# EAGLE design DCDCDC-R2 (EAGLE 9.5.1)
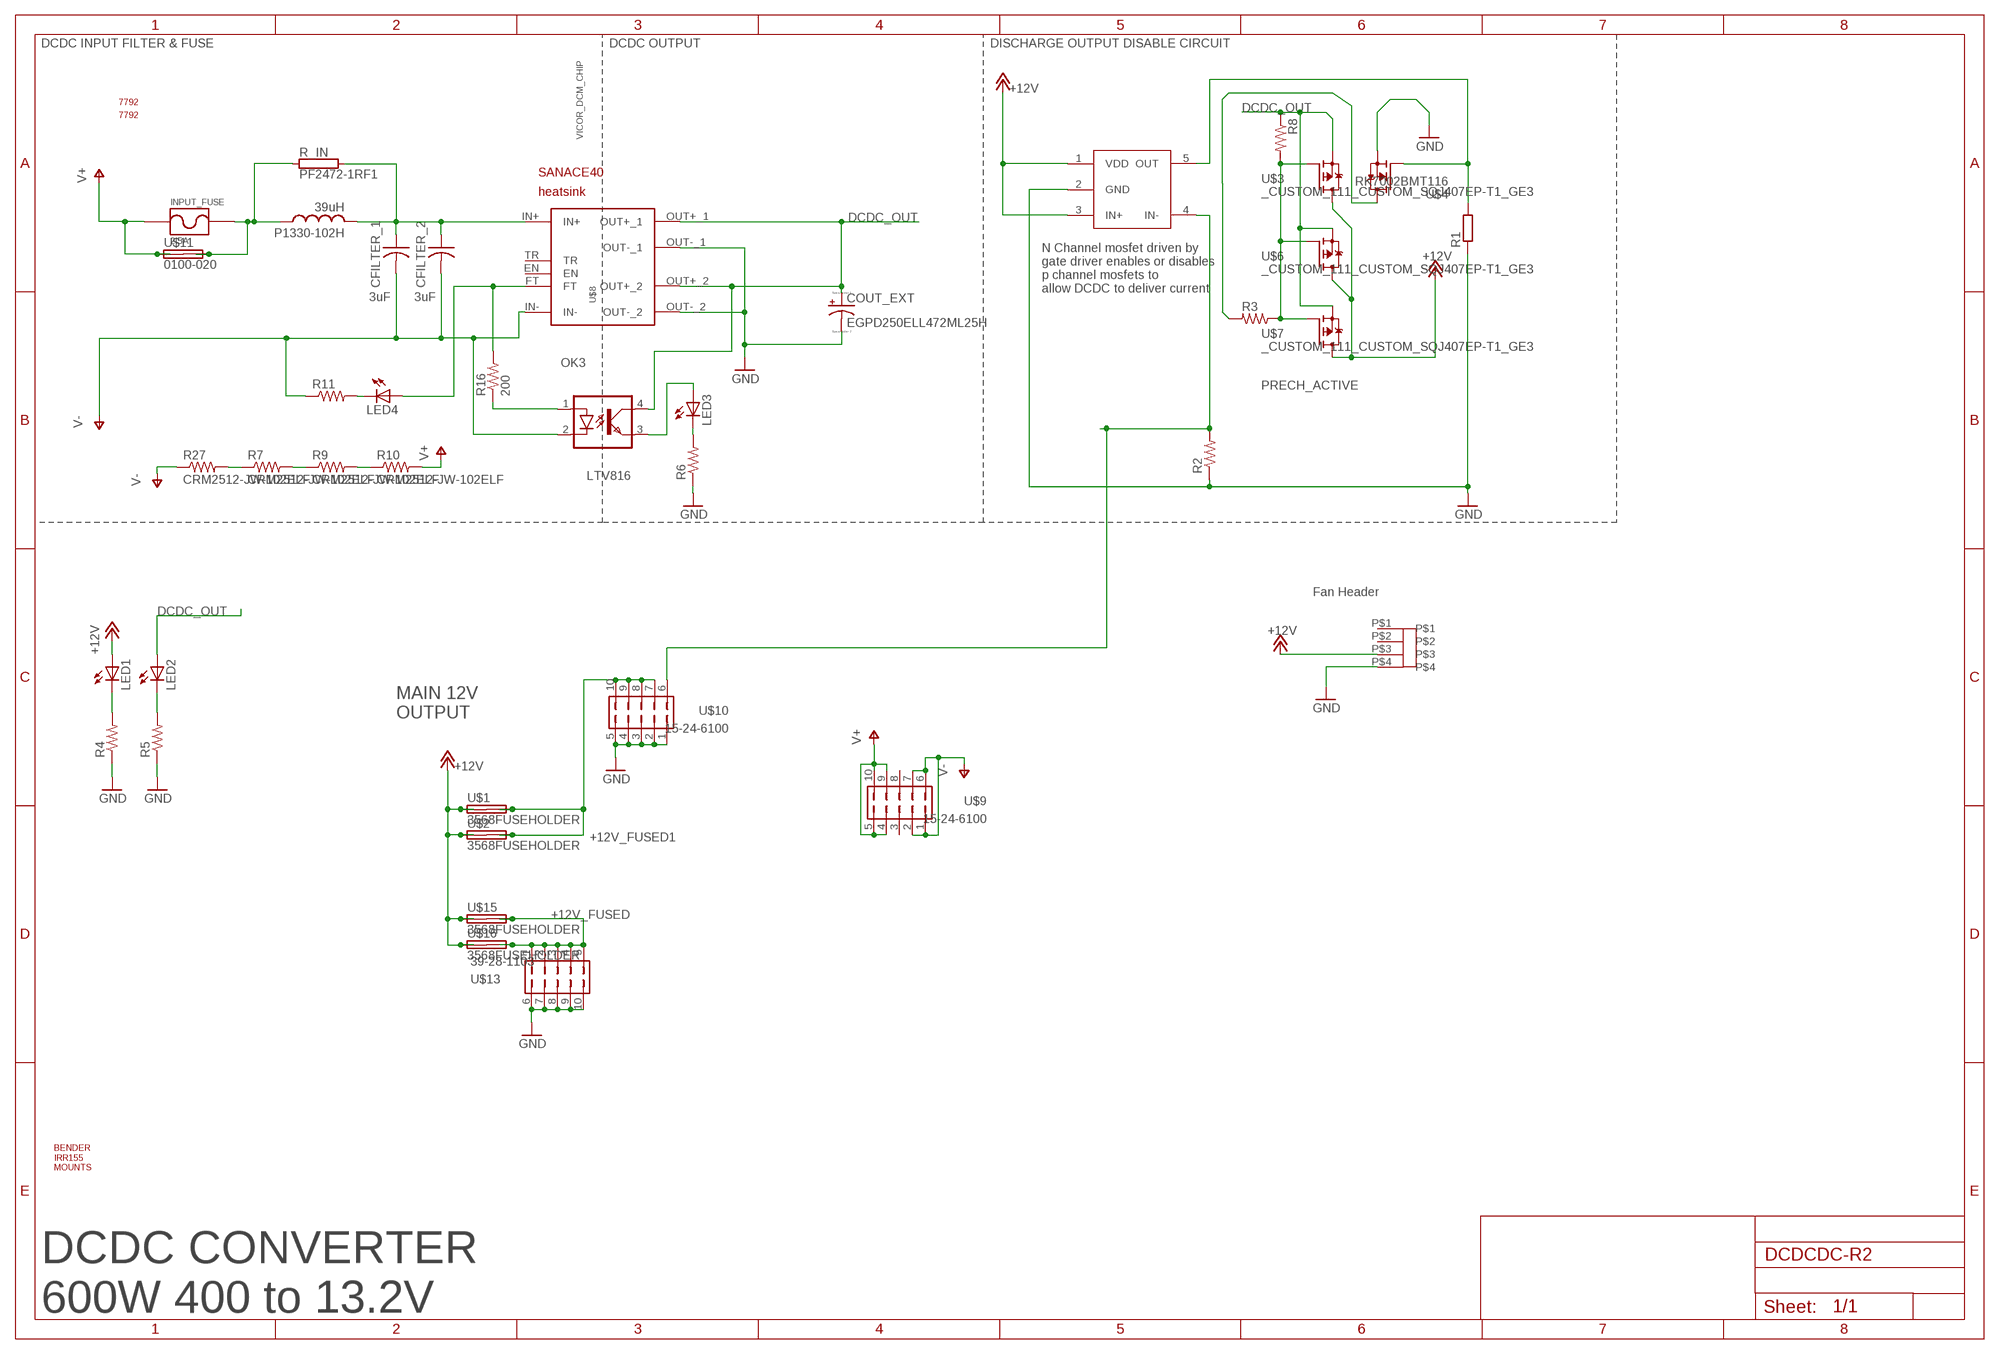
[diagram p0: schematic, sheet 1]

## Parts
CFILTER_1  3uF  B58035U5305M062  [CERALINK_FA3]
CFILTER_2  3uF  B58035U5305M062  [CERALINK_FA3]
COUT_EXT  EGPD250ELL472ML25H  CPOL-USE7.5-16  [E7,5-16]
INPUT_FUSE  2.5A  _CUSTOM_PARTS_LF_885  [_CUSTOM_PARTS_LF_885]
LED1  LEDCHIPLED_0805  [CHIPLED_0805]
LED2  LEDCHIPLED_0805  [CHIPLED_0805]
LED3  LEDCHIPLED_0805  [CHIPLED_0805]
LED4  LEDCHIPLED_0805  [CHIPLED_0805]
OK3  LTV816  [DIL04]
P1330-102H  39uH  SRP1770TA-390M  [L_1510_NONSTANDARD]
R1  R-EU_R0805  [R0805]
R2  R-US_R0805  [R0805]
R3  R-US_R0805  [R0805]
R4  R-US_R0805  [R0805]
R5  R-US_R0805  [R0805]
R6  R-US_R0805  [R0805]
R7  CRM2512-JW-102ELF  R-US_R2512  [R2512]
R8  R-US_R0805  [R0805]
R9  CRM2512-JW-102ELF  R-US_R2512  [R2512]
R10  CRM2512-JW-102ELF  R-US_R2512  [R2512]
R11  R-US_R0805  [R0805]
R16  200  R-US_R2010  [R2010]
R27  CRM2512-JW-102ELF  R-US_R2512  [R2512]
R_IN  PF2472-1RF1  RMG100-V  [TO-247-2V]
U$1  3568FUSEHOLDER  [3568]
U$2  3568FUSEHOLDER  [3568]
U$3  _CUSTOM_111_CUSTOM_SQJ407EP-T1_GE3  [_CUSTOM_111_CUSTOM_TRANS_SIRA90DP-T1-GE3]
U$4  RK7002BMT116  [SOT23]
U$5  UCC27511AQDBVRQ1  [SOT23-5L]
U$6  _CUSTOM_111_CUSTOM_SQJ407EP-T1_GE3  [_CUSTOM_111_CUSTOM_TRANS_SIRA90DP-T1-GE3]
U$7  _CUSTOM_111_CUSTOM_SQJ407EP-T1_GE3  [_CUSTOM_111_CUSTOM_TRANS_SIRA90DP-T1-GE3]
U$8  VICOR_DCM_CHIP  [VICOR_CHIP_HEATSINK]
U$9  15-24-6100  [15-24-6100]
U$10  15-24-6100  [15-24-6100]
U$11  0100-020  [0100-020]
U$12  VICOR_HEATSINK_DOUBLE  [VICOR_HEATSINK_DOUBLE]
U$13  39-28-1103  [39-28-1103]
U$14  7792  [7792]
U$15  3568FUSEHOLDER  [3568]
U$16  3568FUSEHOLDER  [3568]
U$17  7792  [7792]
U$18  9GAX0412P3S0031  SANACE40  [SANACE40]
U$19  470531000  [470531000]
U$20  BENDER_IRR155  [BENDER_IRR155]

## Nets
+12V: LED1.A U$1.L1(1A) U$1.L2(1B) U$2.L1(1A) U$2.L2(1B) U$3.5(D) U$5.1(VDD) U$5.3(IN+) U$6.5(D) U$7.5(D) U$15.L1(1A) U$15.L2(1B) U$16.L1(1A) U$16.L2(1B) U$19.P$3
+12V_FUSED: U$13.1 U$13.2 U$13.3 U$13.4 U$13.5 U$15.R1(2A) U$15.R2(2B) U$16.R1(2A) U$16.R2(2B)
+12V_FUSED1: U$1.R1(2A) U$1.R2(2B) U$2.R1(2A) U$2.R2(2B) U$10.7 U$10.8 U$10.9 U$10.10
DCDC_OUT: COUT_EXT.+ LED2.A OK3.4(COL) R8.1 U$3.1(S) U$3.2(S) U$3.3(S) U$6.1(S) U$6.2(S) U$6.3(S) U$7.1(S) U$7.2(S) U$7.3(S) U$8.OUT+_1 U$8.OUT+_2
GND: COUT_EXT.- R1.1 R2.1 R4.1 R5.1 R6.1 U$4.2(S) U$5.2(GND) U$8.OUT-_1 U$8.OUT-_2 U$10.1 U$10.2 U$10.3 U$10.4 U$10.5 U$13.6 U$13.7 U$13.8 U$13.9 U$13.10 U$19.P$4
N$1: R3.1 R8.2 U$3.4(G) U$6.4(G) U$7.4(G)
N$2: R1.2 U$4.1(G) U$5.5(OUT)
N$3 [HV]: CFILTER_1.P$1 CFILTER_2.P$1 P1330-102H.P$2 R_IN.2 U$8.IN+
N$4: R3.2 U$4.3(D)
N$5: LED1.C R4.2
N$6: LED2.C R5.2
N$7: LED4.A R16.2 U$8.FT
N$8: OK3.1(A) R16.1
N$9: LED3.C R6.2
N$10: LED3.A OK3.3(EMIT)
N$11: LED4.C R11.2
N$12: R7.1 R27.2
N$13: R7.2 R9.1
N$14: R9.2 R10.1
PRECH_ACTIVE: R2.2 U$5.4(IN-) U$10.6
V+ [HV]: INPUT_FUSE.P$1 R10.2 U$9.4 U$9.5 U$9.9 U$9.10 U$11.P$1(1A) U$11.P$3(1B)
V+_FUSED [HV]: INPUT_FUSE.P$2 P1330-102H.P$1 R_IN.1 U$11.P$2(2A) U$11.P$4(2B)
V- [HV]: CFILTER_1.P$2 CFILTER_2.P$2 OK3.2(C) R11.1 R27.1 U$8.IN- U$9.1 U$9.2 U$9.6 U$9.7
Unconnected: U$8.EN U$8.TR U$9.3 U$9.8 U$19.P$1 U$19.P$2

## Notes on the sheet
- DCDC INPUT FILTER & FUSE | DCDC OUTPUT | DISCHARGE OUTPUT DISABLE CIRCUIT
- N Channel mosfet driven by 
  gate driver enables or disables 
  p channel mosfets to 
  allow DCDC to deliver current
- Fan Header
- MAIN 12V
  OUTPUT
- DCDC CONVERTER 
  600W 400 to 13.2V

## Library data of the parts
CFILTER_1 CFILTER_2 = ACC-MB-R0:B58035U5305M062
COUT_EXT = ACC-MB-R0:CPOL-US: POLARIZED CAPACITOR, American symbol
INPUT_FUSE = ACC-MB-R0:_CUSTOM_PARTS_LF_885
LED1-LED4 = ACC-MB-R0:LED: LED OSRAM: - CHIPLED LG R971, LG N971, LY N971, LG Q971, LY Q971, LO R971, LY R971 LH N974, LH R974 LS Q976, LO Q976, LY Q976 LO Q996 - Hyper CHIPLED LW Q18S LB Q993, LB Q99A, LB R99A - SideLED LS A670, LO A670, LY A670, LG A670, LP A670 LB A673, LV A673, LT A673, LW A673 LH A674 LY A675 LS A676, LA A676, LO A676, LY A676, LW A676 LS A679, LY A679, LG A679 - Hyper Micro SIDELED® LS Y876, LA Y876, LO Y876, LY Y876 LT Y87S - SmartLED LW L88C, LW L88S LB L89C, LB L89S, LG L890 LS L89K, LO L89K, LY L89K LS L896, LA L896, LO L896, LY L896 - TOPLED LS T670, LO T670, LY T670, LG T670, LP T670 LSG T670, LSP T670, LSY T670, LOP T670, LYG T670 LG T671, LOG T671, LSG T671 LB T673, LV T673, LT T673, LW T673 LH T674 LS T676, LA T676, LO T676, LY T676, LB T676, LH T676, LSB T676, LW T676 LB T67C, LV T67C, LT T67C, LS T67K, LO T67K, LY T67K, LW E67C LS E67B, LA E67B, LO E67B, LY E67B, LB E67C, LV E67C, LT E67C LW T67C LS T679, LY T679, LG T679 LS T770, LO T770, LY T770, LG T770, LP T770 LB T773, LV T773, LT T773, LW T773 LH T774 LS E675, LA E675, LY E675, LS T675 LS T776, LA T776, LO T776, LY T776, LB T776 LHGB T686 LT T68C, LB T68C - Hyper Mini TOPLED® LB M676 - Mini TOPLED Santana® LG M470 LS M47K, LO M47K, LY M47K Source: http://www.osram.convergy.de LUXEON: - LUMILED® LXK2-PW12-R00, LXK2-PW12-S00, LXK2-PW14-U00, LXK2-PW14-V00 LXK2-PM12-R00, LXK2-PM12-S00, LXK2-PM14-U00 LXK2-PE12-Q00, LXK2-PE12-R00, LXK2-PE12-S00, LXK2-PE14-T00, LXK2-PE14-U00 LXK2-PB12-K00, LXK2-PB12-L00, LXK2-PB12-M00, LXK2-PB14-N00, LXK2-PB14-P00, LXK2-PB14-Q00 LXK2-PR12-L00, LXK2-PR12-M00, LXK2-PR14-Q00, LXK2-PR14-R00 LXK2-PD12-Q00, LXK2-PD12-R00, LXK2-PD12-S00 LXK2-PH12-R00, LXK2-PH12-S00 LXK2-PL12-P00, LXK2-PL12-Q00, LXK2-PL12-R00 Source: www.luxeon.com KINGBRIGHT: KA-3528ASYC Source: www.kingbright.com
OK3 = optocoupler:LTV816: OPTO COUPLER Source: LITEON, LTV816.pdf; OC_FARNELL: unknown; OC_NEWARK: unknown
P1330-102H = ACC-MB-R0:SRP1770TA-390M
R1 = ACC-MB-R0:R-EU_: RESISTOR, European symbol; SPICEPREFIX: R
R2-R11 R27 = ACC-MB-R0:R-US_: RESISTOR, American symbol; SPICEPREFIX: R
R16 = Main:R-US_: RESISTOR, American symbol; SPICEPREFIX: R
R_IN = ACC-MB-R0:RMG100: TO-247 Power Resistor - RMG 100 Series Source: www.token.com.tw .. power-resistor-rmg100pdf; OC_FARNELL: unknown; OC_NEWARK: unknown
U$1 U$2 U$15 U$16 = ACC-MB-R0:3568FUSEHOLDER: 3568 20AMP 500VAC
U$3 U$6 U$7 = ACC-MB-R0:_CUSTOM_111_CUSTOM_SQJ407EP-T1_GE3
U$4 = ACC-MB-R0:RK7002BMT116
U$5 = ACC-MB-R0:UCC27511AQDBVRQ1
U$8 = ACC-MB-R0:VICOR_DCM_CHIP
U$9 U$10 = ACC-MB-R0:15-24-6100
U$11 = ACC-MB-R0:0100-020
U$12 = ACC-MB-R0:VICOR_HEATSINK_DOUBLE
U$13 = ACC-MB-R0:39-28-1103
U$14 U$17 = ACC-MB-R0:7792
U$18 = ACC-MB-R0:SANACE40
U$19 = ACC-MB-R0:470531000
U$20 = ACC-MB-R0:BENDER_IRR155

## Net classes
0 default: width 0.2 mm, clearance 0.2 mm
1 HV: width 1.27 mm, clearance 1.5 mm to class 0, clearance 1.5 mm

## Board
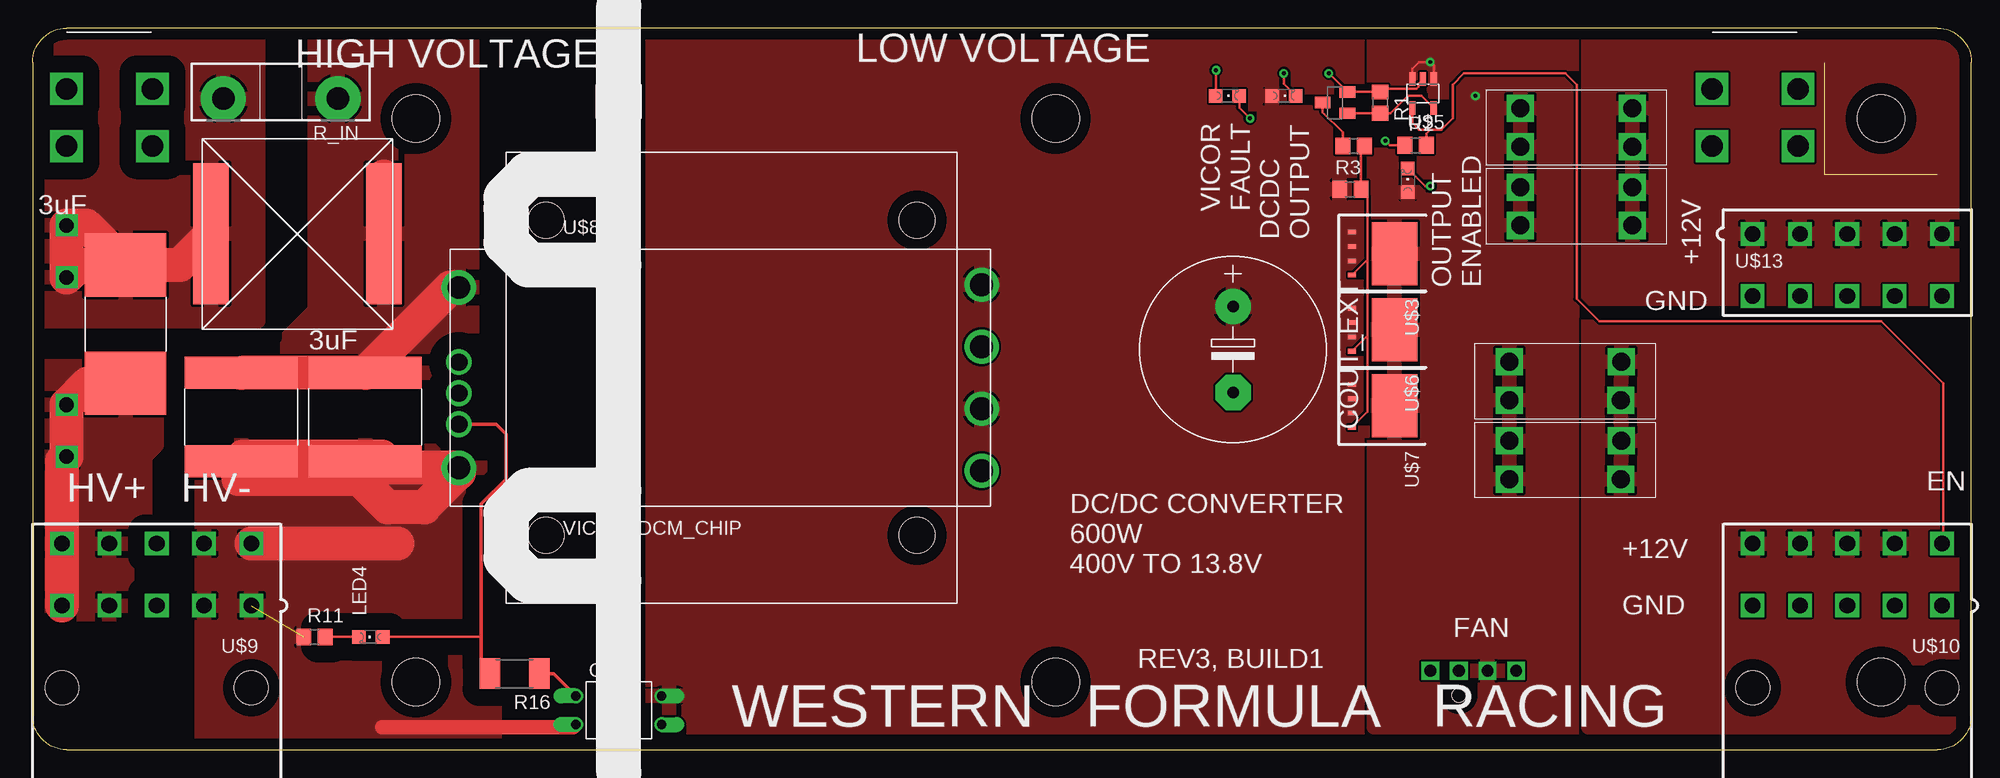
[diagram p1: board, top side]
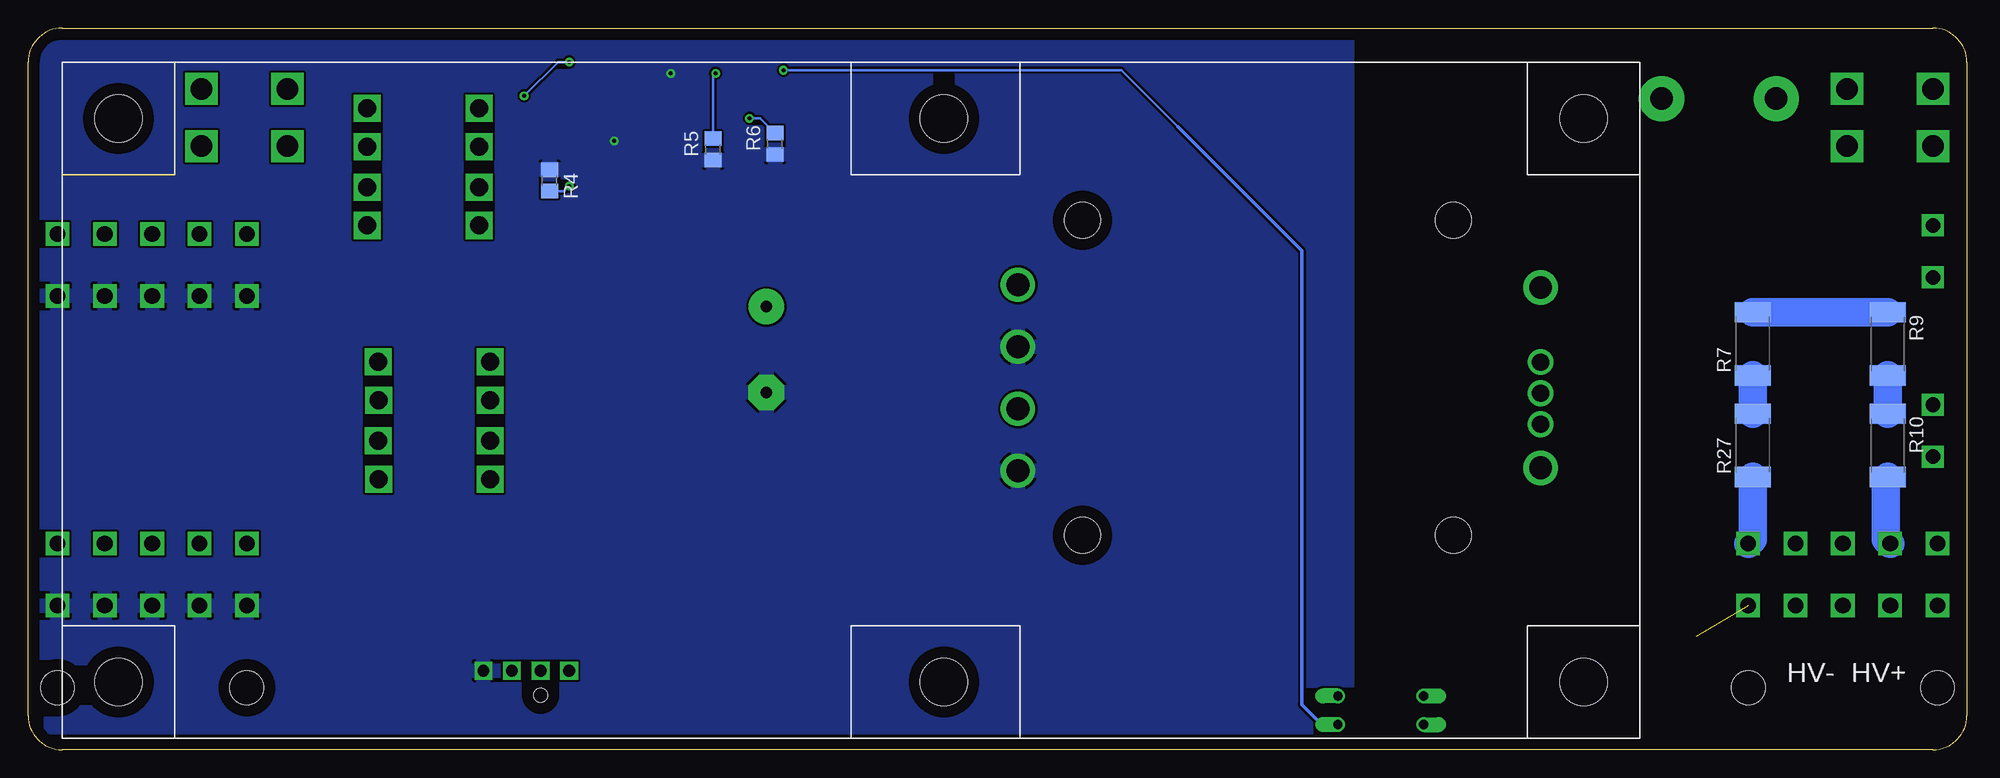
[diagram p2: board, bottom side, seen from below]

Size 172 x 64 mm. Coordinates in mm from the lower left corner, seen from the top.
Outline: 169,64 3,64 arc90 0,61 0,3 arc90 3,0 169,0 arc90 172,3 172,61 arc90 169,64
Copper layers (1*16): Top 0.035mm / dielectric 1.5mm / Bottom 0.035mm
Design rules "default": minimum track width 6mil, minimum drill 0.35mm, track to track 6mil, track to pad 6mil, pad to pad 6mil, via to via 6mil, smd to smd 6mil, copper to edge 40mil, drill to drill 6mil, minimum pad ring 10mil, minimum via ring 8mil, stop-mask expansion 4mil, vias tented up to drill 0mil, thermal gap 10mil

### Footprints (pad centres in the part's own frame; a part is rotated, then mirrored left to right if it is on the bottom)
CERALINK_FA3 = smd 2.85 x 10: P$1 -3.925,0; P$2 3.925,0
E7,5-16 = drill 1.016 pad 3.15: + -3.81,0 | drill 1.016 pad 3.15 octagon: - 3.81,0
_CUSTOM_PARTS_LF_885 = smd 5.6 x 7.23: P$1 5.25,0; P$2 -5.25,0
CHIPLED_0805 = smd 1.2 x 1.2: A 0,-1.05; C 0,1.05
DIL04 = drill 0.813 offset: 1 -1.27,-3.81; 2 1.27,-3.81; 3 1.27,3.81; 4 -1.27,3.81
L_1510_NONSTANDARD = smd 3.15 x 12.5: P$1 -7.675,0; P$2 7.675,0
R0805 = smd 1.3 x 1.5: 1 -0.95,0; 2 0.95,0
R2512 = smd 1.8 x 3.2: 1 -2.8,0; 2 2.8,0
R2010 = smd 1.8 x 2.7: 1 -2.2,0; 2 2.2,0
TO-247-2V = drill 2 pad 4: 1 -5.08,0; 2 5.08,0
3568 = drill 1.6 square: L1 0,3.4; L2 0,0; R1 9.94,3.4; R2 9.92,0
_CUSTOM_111_CUSTOM_TRANS_SIRA90DP-T1-GE3 = smd 0.41 x 0.72: 1 -1.905,-2.715; 2 -0.635,-2.715; 3 0.635,-2.715; 4 1.905,-2.715 | smd 5.588 x 4.064: 5 0,1.08
SOT23 = smd 1 x 1.4: 1 -0.95,-1.1; 2 0.95,-1.1; 3 0,1.1
SOT23-5L = smd 0.55 x 1.2: 1 -0.95,-1.3; 2 0,-1.3; 3 0.95,-1.3; 4 0.95,1.3; 5 -0.95,1.3
VICOR_CHIP_HEATSINK = drill 1.52 pad 1.77: EN -23.19,-1.38; FT -23.19,-4.13; TR -23.19,1.38 | drill 2.03 pad 2.28: IN+ -23.19,8; IN- -23.19,-8 | drill 2.03 pad 2.41: OUT+_1 23.19,8.25; OUT+_2 23.19,-2.75; OUT-_1 23.19,2.75; OUT-_2 23.19,-8.25
15-24-6100 = drill 1.4 square: 1 8.4,-2.75; 2 4.2,-2.75; 3 0,-2.75; 4 -4.2,-2.75; 5 -8.4,-2.75; 6 8.4,2.75; 7 4.2,2.75; 8 0,2.75; 9 -4.2,2.75; 10 -8.4,2.75 | hole 3: 8.4,-10.05; -8.4,-10.05
0100-020 = drill 1.3 square: P$1 0,0; P$2 15.9,0; P$3 4.6,0; P$4 20.5,0
VICOR_HEATSINK_DOUBLE = hole 3.175: -16.459,13.97; -16.459,-13.97; 16.459,13.97; 16.459,-13.97
39-28-1103 = drill 1.4 square: 1 -8.4,-2.75; 2 -4.2,-2.75; 3 0,-2.75; 4 4.2,-2.75; 5 8.4,-2.75; 6 -8.4,2.75; 7 -4.2,2.75; 8 0,2.75; 9 4.2,2.75; 10 8.4,2.75
7792 = drill 1.905 square: P$1 0,5.08; P$2 7.62,5.08; P$3 7.62,0; P$4 0,0
470531000 = drill 1.05 square: P$1 0,0; P$2 2.54,0; P$3 5.08,0; P$4 7.62,0 | hole 1.25: 2.54,-2.16
BENDER_IRR155 = hole 4.2: 5,5; 5,55; 78.25,55; 78.25,5; 135,55; 135,5

### Placement (x,y rotation side)
CFILTER_1  29.5,29.5 270 top
CFILTER_2  18.5,29.5 270 top
COUT_EXT  106.5,35.5 270 top
INPUT_FUSE  8.25,37.75 270 top
LED1  122,50.5 0 top
LED2  111,58 270 top
LED3  106,58 270 top
LED4  30,10 90 top
OK3  52,3.5 270 top
P1330-102H  23.5,45.75 0 top
R1  119.55,57.4 270 top
R2  122.7,53.6 0 top
R3  117.2,53.55 180 top
R4  125.75,50.5 270 bottom
R5  111.25,53.25 90 bottom
R6  105.75,53.75 90 bottom
R7  19,36 90 bottom
R8  116.9,49.7 0 top
R9  7,36 270 bottom
R10  7,27 270 bottom
R11  25,10 0 top
R16  42.75,6.75 180 top
R27  19,27 90 bottom
R_IN  22,57.75 0 top
U$1  131,24 0 top
U$2  131,31 0 top
U$3  119.75,44 270 top
U$4  115.55,57.4 90 top
U$5  123.35,58.2 180 top
U$6  119.75,37.25 270 top
U$7  119.75,30.5 270 top
U$8  61,33 0 top
U$9  11,15.54 0 top
U$10  161,15.54 0 top
U$11  3,26 90 top
U$12  62,33 0 top
U$13  161,43 180 top
U$14  3,53.54 0 top
U$15  132,46.5 0 top
U$16  132,53.5 0 top
U$17  149,53.54 0 top
U$18  42,13 0 top
U$19  124,7 0 top
U$20  169,1 0 bottom

### Tracks (layer width: path | path; a pad name or v marks a point on that pad's centre or on a via)
+12V  (via drill 0.35)
  Top 0.2: U$5.3 122.4,60.4 123,61 v124,61 124.3,60.7 U$5.1
  Bottom 0.2: v124,61 125,61 v128,58
  pour Top (rank 2): 119,65 119,2 181,2 181,64 180,65
+12V_FUSED
  pour Top: 138,40 181,40 181,64 180,64 179,65 138,65
+12V_FUSED1
  pour Top: 138,38 138,2 181,2 181,38
DCDC_OUT
  pour Top (rank 3): 55,65 55,2 119,2 119,65
GND  (via drill 0.35)
  Top 0.2: 123.5,59.65 U$5.2 122.93,59.08 122.93,58.8 122.78,58.65 120.15,58.65 119.85,58.35 R1.1 U$4.2 v115,60 | R2.1 120.4,53.6 v120,54
  pour Bottom: 55,65 55,2 181,2 181,65
N$1
  Top 0.2: U$7.4 118.4,29.96 118.4,36.71 | 118.4,36.71 118.4,43.46 | U$6.4 118.4,36.71 | U$3.4 118.4,43.46 | 118.4,43.46 118.4,49.15 R8.2 117.85,53.25 R3.1
N$2
  Top 0.2: U$4.1 R1.2 120.45,56.45 122,58 123.2,58 U$5.5
N$3
  Top 1.27: 19,33 18.57,33.42 CFILTER_2.P$1
  Top 3: P1330-102H.P$2 31.18,50.83 | CFILTER_2.P$1 CFILTER_1.P$1 37.08,41 U$8.IN+
  pour Top (rank 2): 19,33 39,33 39,63 25,63 25,39
N$4
  Top 0.2: R3.2 116.25,54.75 114.45,56.55 U$4.3
N$5  (via drill 0.35)
  Top 0.2: v124,50 123.55,50 LED1.C
  Bottom 0.2: R4.2 124.45,49.55 v124,50
N$6  (via drill 0.35)
  Top 0.2: LED2.C 111,59.05 v111,60
  Bottom 0.2: v111,60 111.25,59.75 R5.2
N$7
  Top 0.2: LED4.A 39.8,10
  Top 0.305: R16.2 39.8,7.5 39.8,10 39.8,21.8 42,24 42,28 41.13,28.87 U$8.FT
N$8
  Top 0.305: OK3.1 46.21,6.75 R16.1
N$9  (via drill 0.35)
  Top 0.2: LED3.C 107.05,56.95 v108,56
  Bottom 0.2: v108,56 107.05,56 R6.2
N$10  (via drill 0.35)
  Top 0.2: v105,60.27 105,58.05 LED3.A
  Bottom 0.2: v105,60.27 75,60.27 70,55.27
  Bottom 0.305: 70,55.27 59,44.27 59,4 57.23,2.23 OK3.3
N$11
  Top 0.2: R11.2 LED4.C
N$12
  Bottom 2.54: R7.1 R27.2
N$13
  Bottom 2.54: R9.1 R7.2
N$14
  Bottom 2.54: R9.2 R10.1
PRECH_ACTIVE
  Top 0.2: U$5.4 122.4,55.6 123,55 124,55 | 124,55 125,55 126,56 126,59 127,60 136,60 137,59 137,40 139,38 164,38 169.5,32.5 169.5,18.97 U$10.6 | R2.2 123.65,54.65 124,55
V+
  Top 3: INPUT_FUSE.P$1 4.9,32.5 U$11.P$3 U$11.P$1 2.6,25.6 U$9.10 U$9.5
  Bottom 2.54: U$9.9 7.18,18.67 7.18,24.02 R10.2
  pour Top (rank 2): -3,12 10,12 10,26 11,27 11,34 -3,34
V+_FUSED
  Top 3: INPUT_FUSE.P$2 4.1,43 U$11.P$2 U$11.P$4 4.75,46.5 INPUT_FUSE.P$2 | INPUT_FUSE.P$2 13.07,43 P1330-102H.P$1
  pour Top: -5,38 20,38 20,68.75 -5,68.75
V-  (1 unrouted)
  Top 0.305: 48.06,2.36 OK3.2
  Top 1.27: OK3.2 47.96,2 31,2
  Top 3: 31,26 18.68,26 CFILTER_2.P$2 18.25,24 29,24 31.5,21.5 34.75,21.5 37.81,24.56 U$8.IN- 30.07,25 CFILTER_1.P$2 | 32.37,18.29 U$9.6
  Bottom 2.54: R27.1 19,18.69 U$9.6
  pour Top: 15,27 15,-2 41,-2 41,27

### Text on the board
tPlace: LOW VOLTAGE | HIGH VOLTAGE | HV+ HV- | DC/DC CONVERTER / 600W / 400V TO 13.8V | WESTERN FORMULA RACING
tNames: VICOR / FAULT | DCDC / OUTPUT | +12V | OUTPUT / ENABLED | GND | EN | +12V | GND | FAN | REV3, BUILD1
bNames: HV- HV+